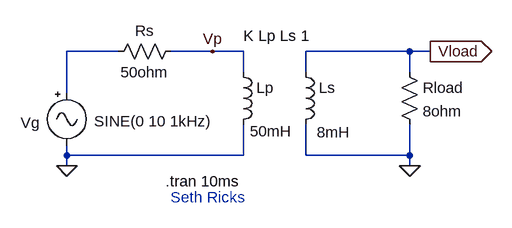
[diagram p0: schematic part3.asc]
part3.asc, the LTspice schematic file:
Version 4.1
SHEET 1 880 680
WIRE -416 96 -496 96
WIRE -272 96 -336 96
WIRE -224 96 -272 96
WIRE 32 96 -128 96
WIRE 64 96 32 96
WIRE -224 128 -224 96
WIRE -128 128 -128 96
WIRE 32 128 32 96
WIRE -496 160 -496 96
WIRE -496 256 -496 240
WIRE -224 256 -224 208
WIRE -224 256 -496 256
WIRE -128 256 -128 208
WIRE 32 256 32 208
WIRE 32 256 -128 256
WIRE -496 272 -496 256
WIRE 32 272 32 256
FLAG -496 272 0
FLAG 32 272 0
FLAG 64 96 Vload
IOPIN 64 96 Out
FLAG -272 96 Vp
SYMBOL Misc\\signal -496 144 R0
WINDOW 0 -71 62 Left 2
WINDOW 3 42 59 Left 2
SYMATTR InstName Vg
SYMATTR Value SINE(0 10 1kHz)
SYMBOL res -320 80 R90
WINDOW 0 0 56 VBottom 2
WINDOW 3 32 56 VTop 2
SYMATTR InstName Rs
SYMATTR Value 50ohm
SYMBOL ind -240 112 R0
WINDOW 3 26 107 Left 2
SYMATTR InstName Lp
SYMATTR Value 50mH
SYMATTR Type ind
SYMBOL ind -144 112 R0
WINDOW 3 33 108 Left 2
SYMATTR InstName Ls
SYMATTR Value 8mH
SYMATTR Type ind
SYMBOL res 16 112 R0
SYMATTR InstName Rload
SYMATTR Value 8ohm
TEXT -344 296 Left 2 !.tran 10ms
TEXT -336 320 Left 2 ;Seth Ricks
TEXT -224 72 Left 2 !K Lp Ls 1

The netlist it stands for:
* part3.asc
Vg N001 0 SINE(0 10 1kHz)
Rs Vp N001 50ohm
Lp Vp 0 50mH
Ls Vload 0 8mH
Rload Vload 0 8ohm
.tran 10ms
* Seth Ricks
K Lp Ls 1
.backanno
.end

* Results of the author's LTspice run, read from the files saved beside the schematic
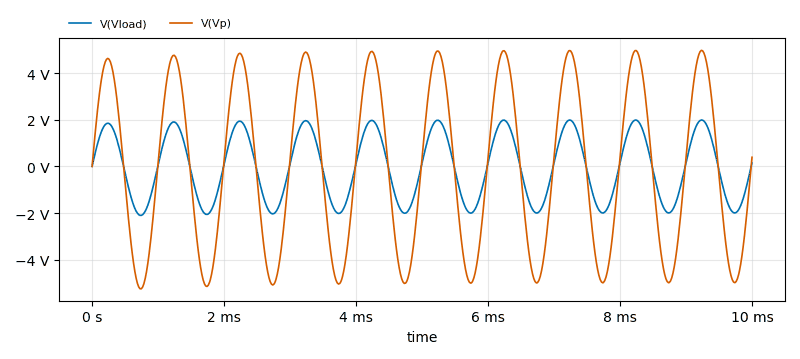
[diagram p1: Transient Analysis of part3.asc, plotted from the saved traces]
* Transient Analysis, 1 run:
*   V(Vload): min -2.098 V, max 1.989 V, average -31.4 mV, rms 1.406 V, last 157 mV
*   V(Vp): min -5.244 V, max 4.973 V, average -78.5 mV, rms 3.514 V, last 392.6 mV